# EAGLE design project2 (EAGLE 9.6.2)
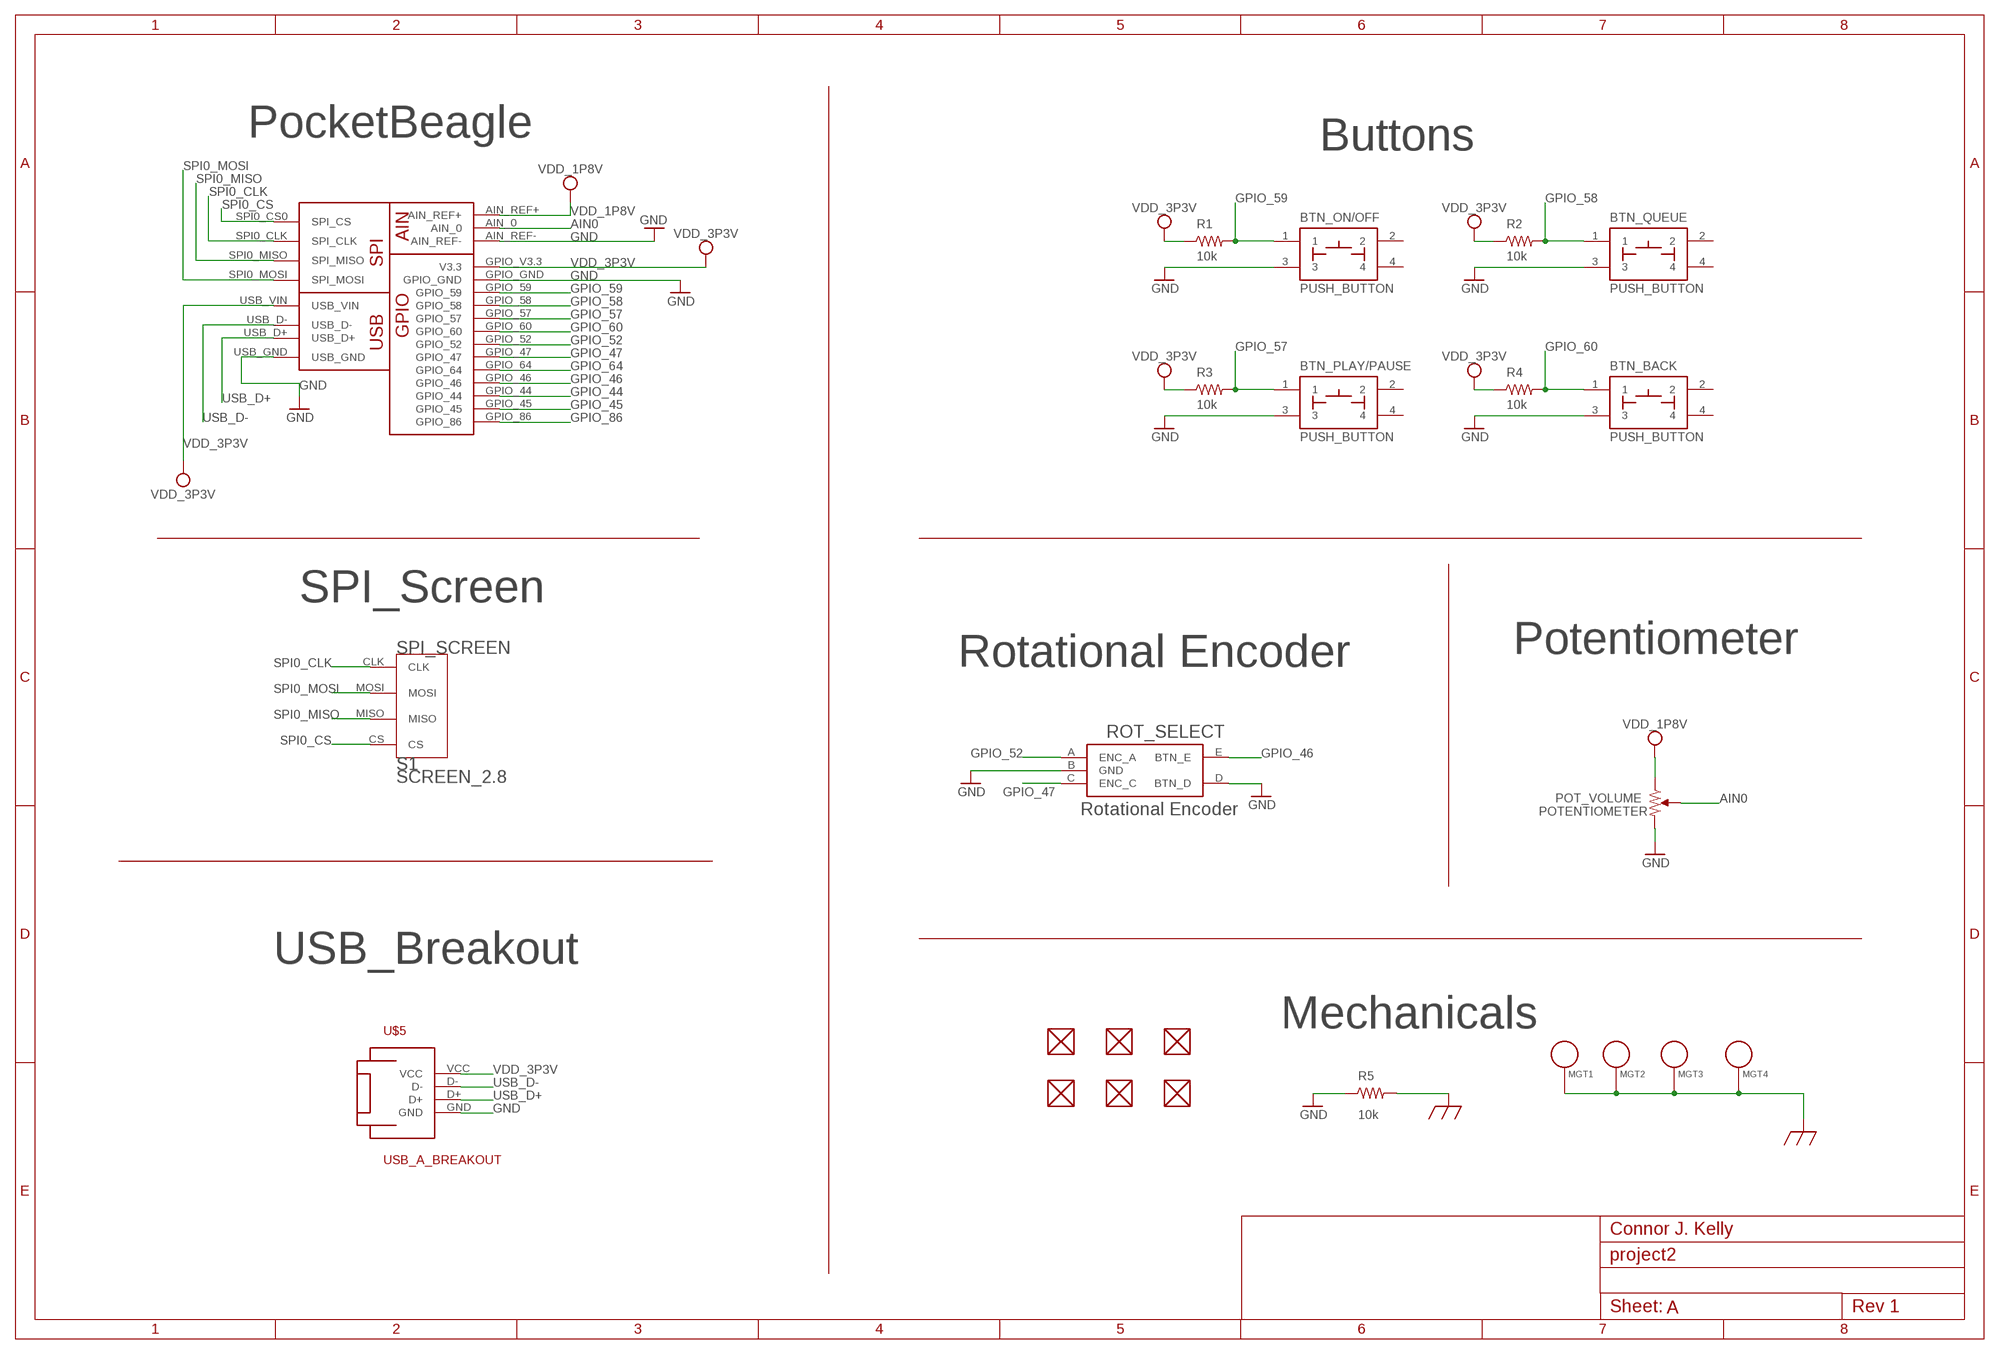
[diagram p0: schematic, sheet 1]

## Parts
BTN_BACK  PUSH_BUTTON  [BUTTON_12.5MM]
BTN_ON/OFF  PUSH_BUTTON  [BUTTON_12.5MM]
BTN_PLAY/PAUSE  PUSH_BUTTON  [BUTTON_12.5MM]
BTN_QUEUE  PUSH_BUTTON  [BUTTON_12.5MM]
FUD1  FIDUCIAL  [FIDUCIAL_40MIL]
FUD2  FIDUCIAL  [FIDUCIAL_40MIL]
FUD3  FIDUCIAL  [FIDUCIAL_40MIL]
FUD4  FIDUCIAL  [FIDUCIAL_40MIL]
FUD5  FIDUCIAL  [FIDUCIAL_40MIL]
FUD6  FIDUCIAL  [FIDUCIAL_40MIL]
MGT1  MOUNTING_HOLE  [MOUNTING_HOLE]
MGT2  MOUNTING_HOLE  [MOUNTING_HOLE]
MGT3  MOUNTING_HOLE  [MOUNTING_HOLE]
MGT4  MOUNTING_HOLE  [MOUNTING_HOLE]
POT_VOLUME  POTENTIOMETER  [POT-PO90S]
R1  10k  R_R0402  [R0402]
R2  10k  R_R0402  [R0402]
R3  10k  R_R0402  [R0402]
R4  10k  R_R0402  [R0402]
R5  10k  R_R0402  [R0402]
ROT_SELECT  PEC16-4015F-S0024  [PEC16-4015F-S0024]
S1  SCREEN_2.8  [SCREEN_2.8]
U$3  POCKETBEAGLE  [POCKETBEAGLE]
U$5  USB_A_BREAKOUT  [USB_A_BREAKOUT]

## Nets
AIN0: POT_VOLUME.S U$3.AIN_0
CGND: MGT1.P$1 MGT2.P$1 MGT3.P$1 MGT4.P$1 R5.2
GND: BTN_BACK.3 BTN_ON/OFF.3 BTN_PLAY/PAUSE.3 BTN_QUEUE.3 POT_VOLUME.CW R5.1 ROT_SELECT.B(GND) ROT_SELECT.D(BTN_D) U$3.AIN_REF- U$3.GPIO_GND U$3.USB_GND U$5.GND
GPIO_44: U$3.GPIO_44
GPIO_45: U$3.GPIO_45
GPIO_46: ROT_SELECT.E(BTN_E) U$3.GPIO_46
GPIO_47: ROT_SELECT.C(ENC_C) U$3.GPIO_47
GPIO_52: ROT_SELECT.A(ENC_A) U$3.GPIO_52
GPIO_57: BTN_PLAY/PAUSE.1 R3.2 U$3.GPIO_57
GPIO_58: BTN_QUEUE.1 R2.2 U$3.GPIO_58
GPIO_59: BTN_ON/OFF.1 R1.2 U$3.GPIO_59
GPIO_60: BTN_BACK.1 R4.2 U$3.GPIO_60
GPIO_64: U$3.GPIO_64
GPIO_86: U$3.GPIO_86
SPI0_CLK: S1.CLK U$3.SPI0_CLK(SPI_CLK)
SPI0_CS: S1.CS U$3.SPI0_CS0(SPI_CS)
SPI0_MISO: S1.MISO U$3.SPI0_MISO(SPI_MISO)
SPI0_MOSI: S1.MOSI U$3.SPI0_MOSI(SPI_MOSI)
USB_D+: U$3.USB_D+ U$5.D+
USB_D-: U$3.USB_D- U$5.D-
VDD_1P8V: POT_VOLUME.CCW U$3.AIN_REF+
VDD_3P3V: R1.1 R2.1 R3.1 R4.1 U$3.GPIO_V3.3(V3.3) U$3.USB_VIN U$5.VCC
Unconnected: BTN_BACK.2 BTN_BACK.4 BTN_ON/OFF.2 BTN_ON/OFF.4 BTN_PLAY/PAUSE.2 BTN_PLAY/PAUSE.4 BTN_QUEUE.2 BTN_QUEUE.4 FUD1.P$1 FUD2.P$1 FUD3.P$1 FUD4.P$1 FUD5.P$1 FUD6.P$1

## Notes on the sheet
- PocketBeagle | Buttons
- SPI_Screen
- Rotational Encoder | Potentiometer
- USB_Breakout
- Mechanicals
- Connor J. Kelly
- A

## Library data of the parts
BTN_BACK BTN_ON/OFF BTN_PLAY/PAUSE BTN_QUEUE = Project2_Main:PUSH_BUTTON: Momentary Press Button Switch; MF: Adafruit
FUD1-FUD6 = Project2_Main:FIDUCIAL
MGT1-MGT4 = Project2_Main:MOUNTING_HOLE: Chassis Mounting Hole w/GND connection ability
POT_VOLUME = Project2_Main:POTENTIOMETER: 10k Ohm 1 Gang Linear Through Hole Potentiometer Detent 1.0 Kierros Conductive Plastic 0.03W, 1/32W PC Pins, Board Locks; MF: TT Electronics/BI
R1-R5 = Project2_Main:R_: RESISTOR, American symbol; MF: Bournes Inc
ROT_SELECT = Project2_Main:PEC16-4015F-S0024: Mechanical Encoder Rotary Incremental Flat 0.02N.m Straight Quadrature Digital Square Wave 24PPR Through Hole PC Pin; DESCRIPTION: Mechanical Encoder Rotary Incremental Flat 0.02N.m Straight Quadrature Digital Square Wave 24PPR Through Hole PC Pin; MF: Bourns; MP: PEC16-4015F-S0024; PURCHASE-URL: https://pricing.snapeda.com/search/part/PEC16-4015F-S0024/?ref=eda
S1 = Project2_Main:SCREEN_2.8: SPI Screen, TFT, 2.8in; MF: Adafruit
U$3 = Project2_Main:POCKETBEAGLE: PocketBeagle is an ultra-tiny-yet-complete open-source USB-key-fob computer. PocketBeagle features an incredible low cost, slick design and simple usage, making PocketBeagle the ideal development board for beginners and professionals alike.; MF: BeagleBoard
U$5 = Project2_Main:USB_A_BREAKOUT: USB Breakout Board; MF: SparkFun

## Board
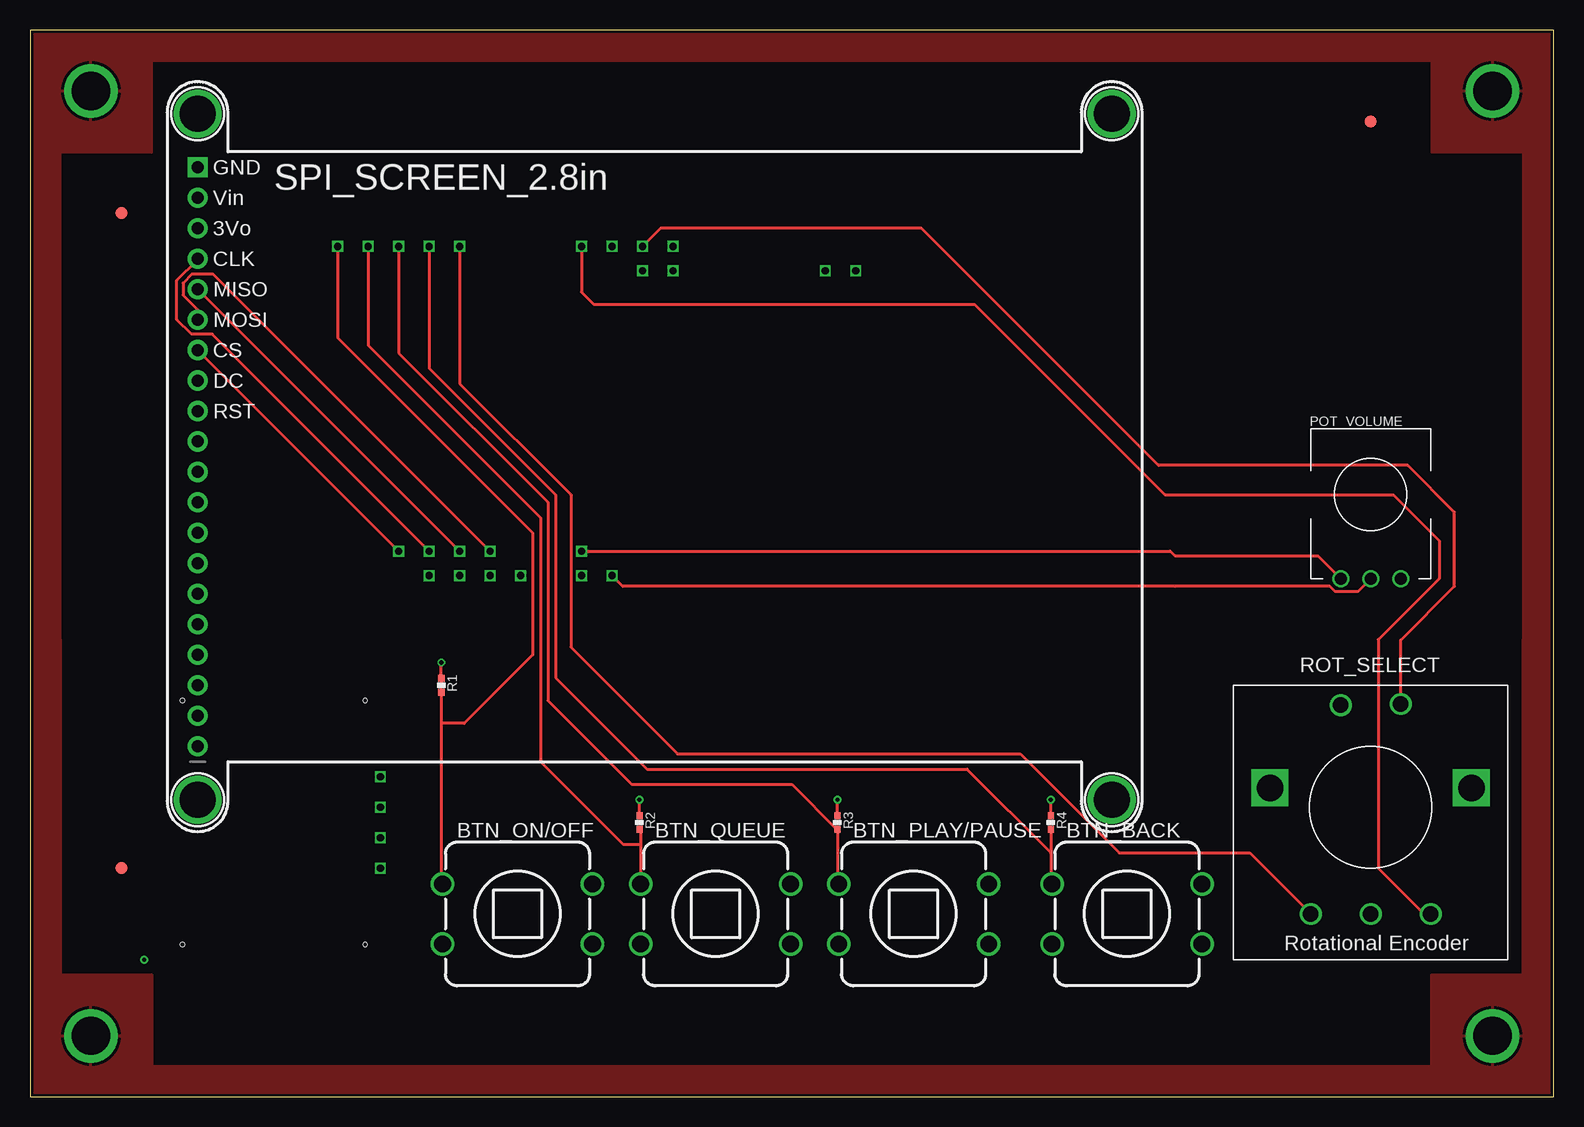
[diagram p1: board, top side]
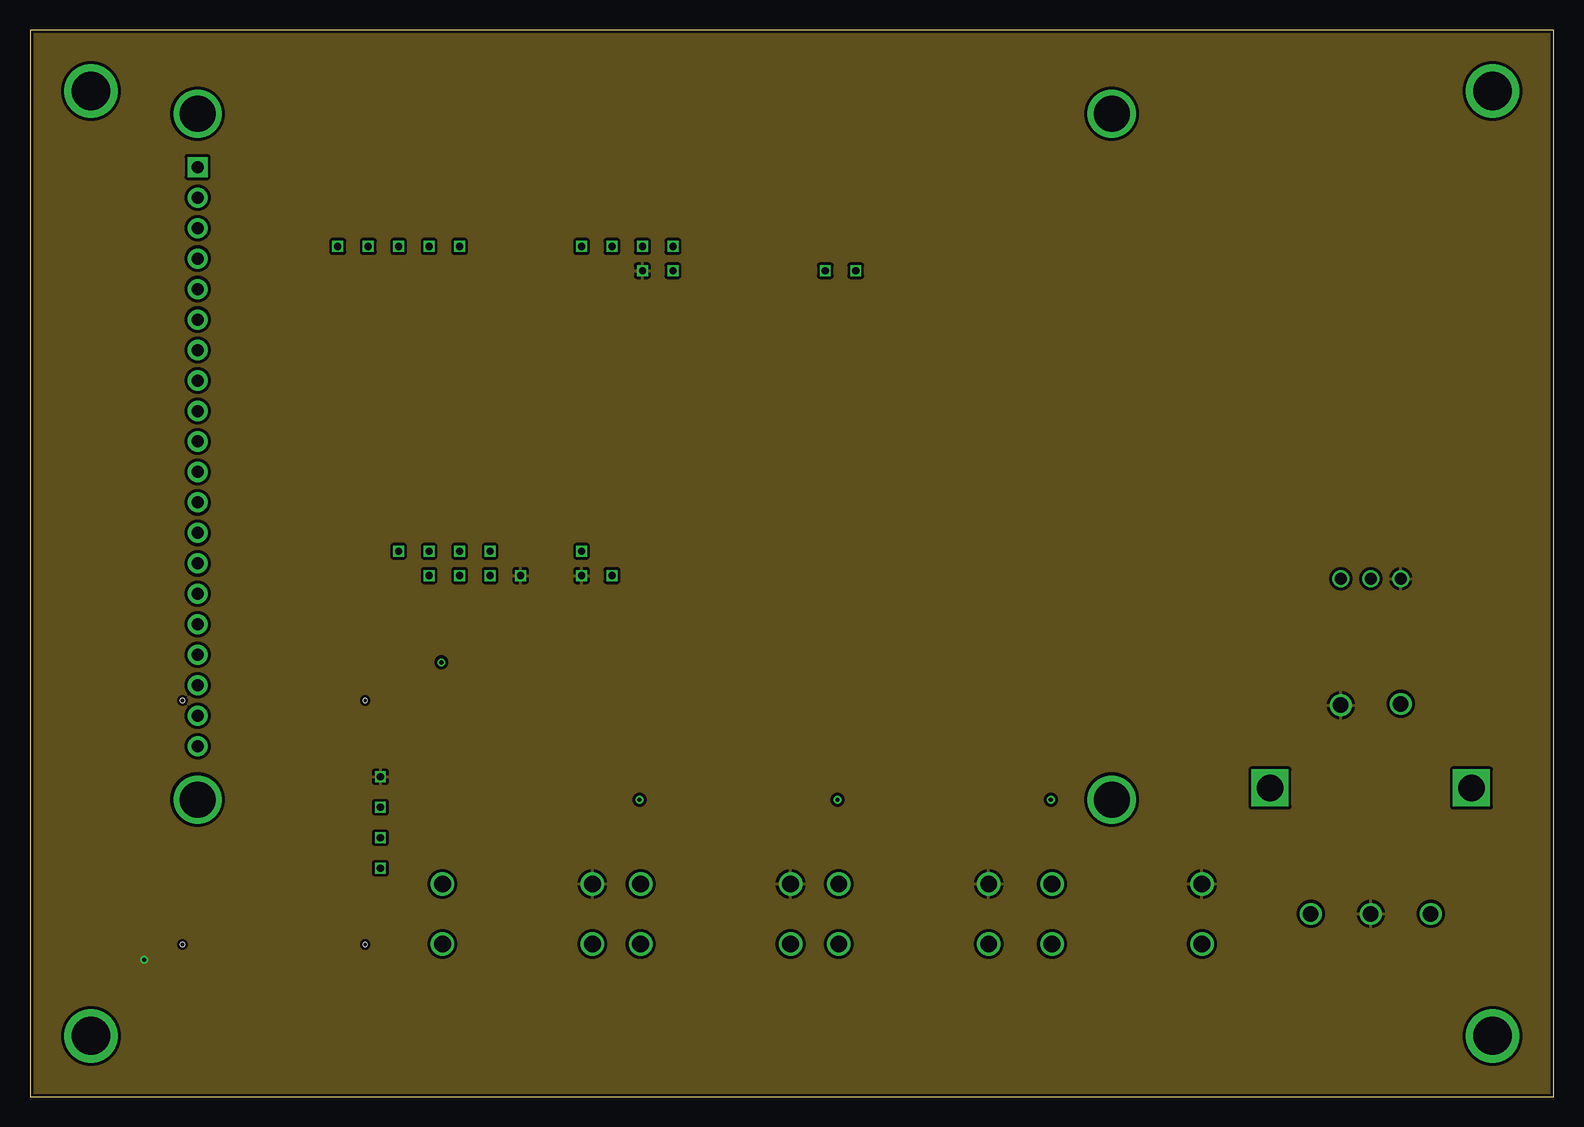
[diagram p2: board, inner layer Route2]
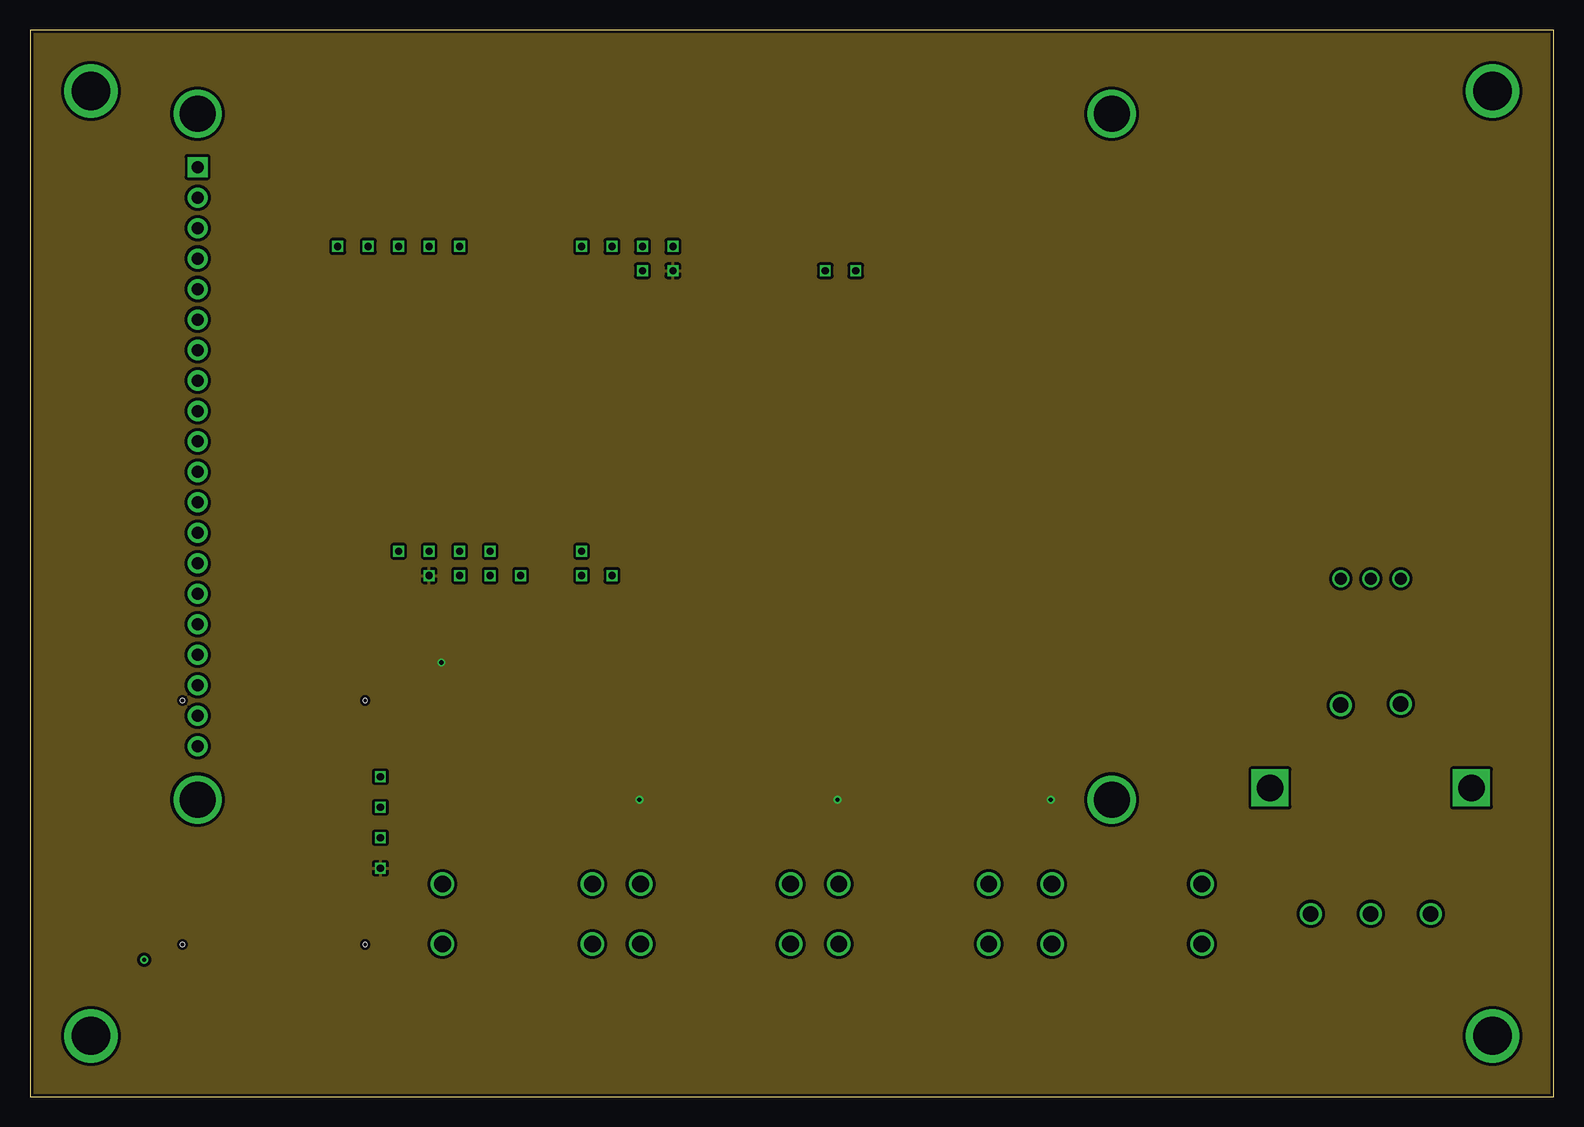
[diagram p3: board, inner layer Route15]
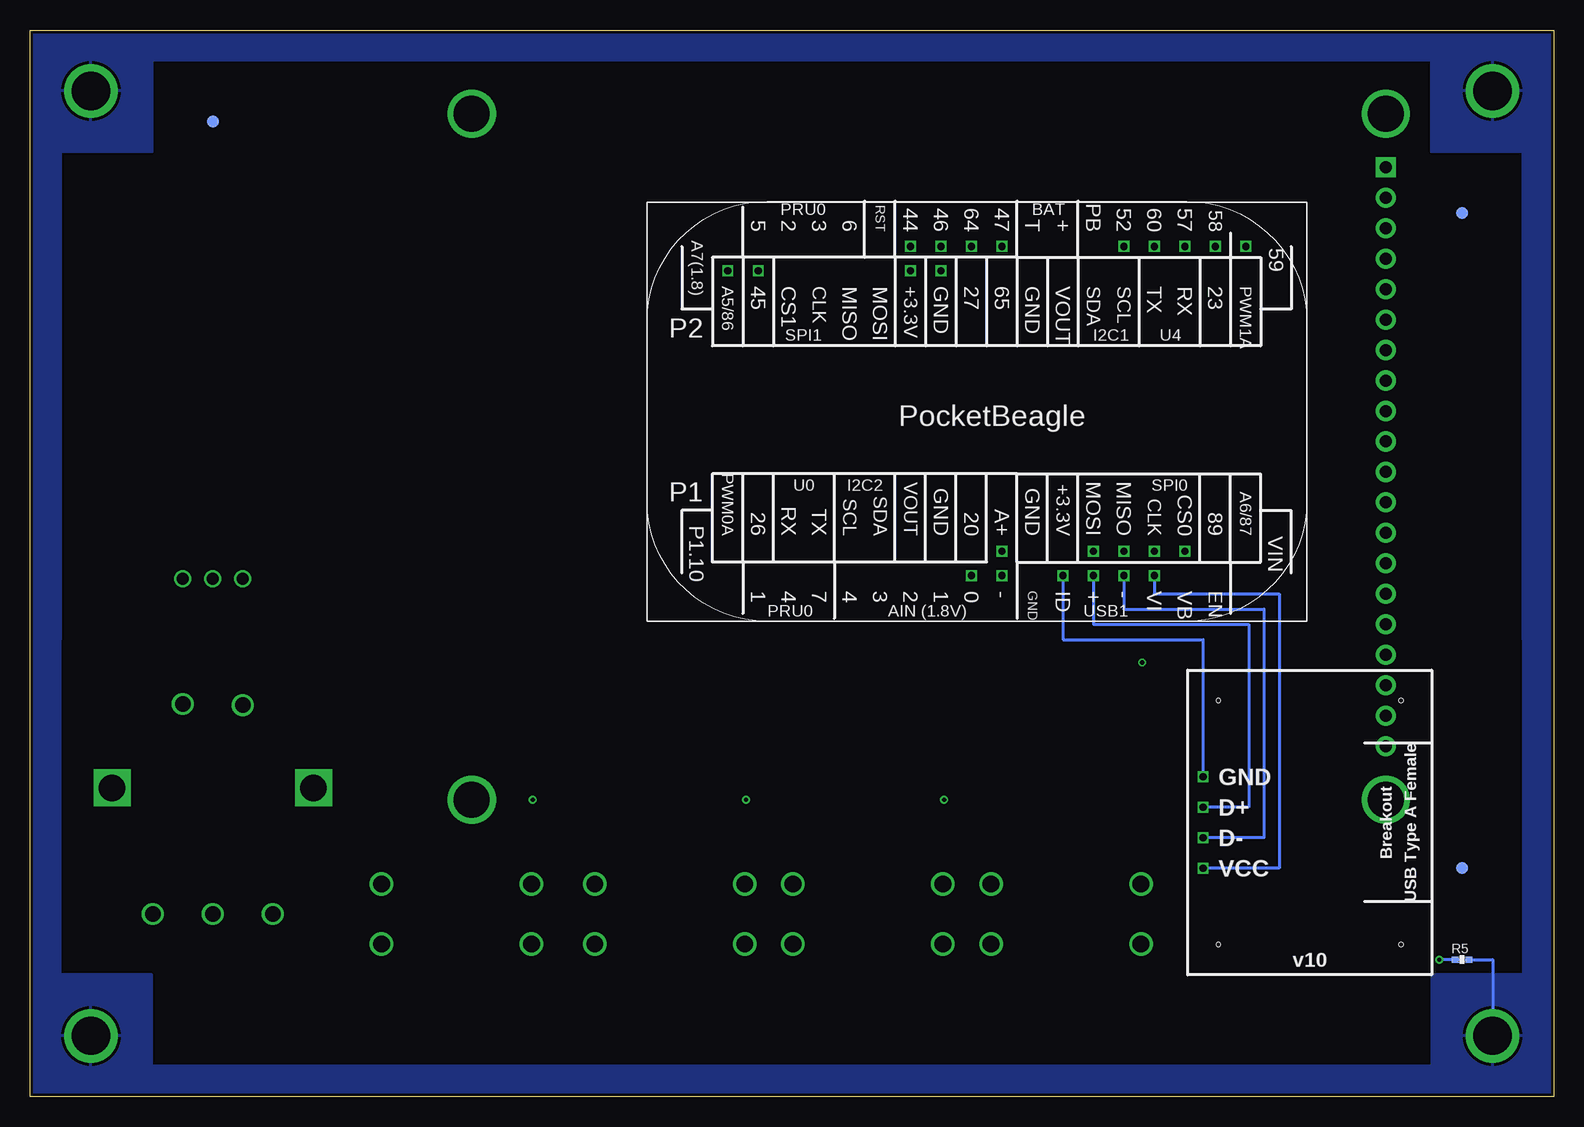
[diagram p4: board, bottom side, seen from below]

Size 127 x 88.9 mm. Coordinates in mm from the lower left corner, seen from the top.
Outline: 0,0 127,0 127,88.9 0,88.9 0,0
Copper layers (1*2*15*16): Top 0.035mm / dielectric 0.23mm / Route2 0.035mm / dielectric 0.93mm / Route15 0.035mm / dielectric 0.23mm / Bottom 0.035mm
Design rules "ENGI301_4lyr *": minimum track width 10mil, minimum drill 12mil, track to track 10mil, track to pad 10mil, pad to pad 10mil, via to via 10mil, smd to smd 10mil, copper to edge 10mil, drill to drill 12mil, minimum pad ring 6mil, minimum via ring 6mil, stop-mask expansion 3mil, vias tented up to drill 25mil, thermal gap 10mil

### Footprints (pad centres in the part's own frame; a part is rotated, then mirrored left to right if it is on the bottom)
BUTTON_12.5MM = drill 1.4: 1 -6.25,2.5; 2 -6.25,-2.5; 3 6.25,2.5; 4 6.25,-2.5
FIDUCIAL_40MIL = smd 1.016 x 1.016: P$1 0,0
MOUNTING_HOLE = drill 3.175 pad 4.445: P$1 0,0
POT-PO90S = drill 1: CCW -2.5,0; CW 2.5,0; S 0,0
R0402 = smd 0.61 x 0.508: 1 -0.559,0; 2 0.559,0
PEC16-4015F-S0024 = drill 2.2 square: 1 -8.4,10.5; 2 8.4,10.5 | drill 1.3: A -5,0; B 0,0; C 5,0; D -2.5,17.4; E 2.5,17.5
SCREEN_2.8 = drill 1 pad 1.676: 3VO -19.05,-38.1; 10@JP2 -1.27,-38.1; 11@JP2 1.27,-38.1; 12@JP2 3.81,-38.1; 13@JP2 6.35,-38.1; 14@JP2 8.89,-38.1; 15@JP2 11.43,-38.1; 16@JP2 13.97,-38.1; 17@JP2 16.51,-38.1; 18@JP2 19.05,-38.1; 19@JP2 21.59,-38.1; 20@JP2 24.13,-38.1; CLK -16.51,-38.1; CS -8.89,-38.1; DC -6.35,-38.1; MISO -13.97,-38.1; MOSI -11.43,-38.1; RST -3.81,-38.1; VIN -21.59,-38.1 | drill 1 pad 1.676 square: GND -24.13,-38.1 | drill 3 pad 3.6: P$1@U$7 -28.575,-38.1; P$1@U$15 28.575,-38.1; P$1@U$16 -28.575,38.1; P$1@U$17 28.575,38.1
POCKETBEAGLE = drill 0.6 square: AIN_0 28.194,4.064; AIN_REF+ 25.654,6.096; AIN_REF- 25.654,4.064; GPIO_44 33.274,31.496; GPIO_45 45.974,29.464; GPIO_46 30.734,31.496; GPIO_47 25.654,31.496; GPIO_52 15.494,31.496; GPIO_57 10.414,31.496; GPIO_58 7.874,31.496; GPIO_59 5.334,31.496; GPIO_60 12.954,31.496; GPIO_64 28.194,31.496; GPIO_86 48.514,29.464; GPIO_GND 30.734,29.464; GPIO_V3.3 33.274,29.464; SPI0_CLK 12.954,6.096; SPI0_CS0 10.414,6.096; SPI0_MISO 15.494,6.096; SPI0_MOSI 18.034,6.096; USB_D+ 18.034,4.064; USB_D- 15.494,4.064; USB_GND 20.574,4.064; USB_VIN 12.954,4.064
USB_A_BREAKOUT = drill 0.6 square: D+ 19.05,11.43; D- 19.05,13.97; GND 19.05,8.89; VCC 19.05,16.51 | hole 0.35: 2.54,22.86; 17.78,22.86; 17.78,2.54; 2.54,2.54

### Placement (x,y rotation side)
BTN_BACK  91.44,15.24 0 top
BTN_ON/OFF  40.64,15.24 0 top
BTN_PLAY/PAUSE  73.66,15.24 0 top
BTN_QUEUE  57.15,15.24 0 top
FUD1  7.62,19.05 0 top
FUD2  111.76,81.28 0 top
FUD3  7.62,73.66 0 top
FUD4  7.62,19.05 270 bottom
FUD5  7.62,73.66 0 bottom
FUD6  111.76,81.28 0 bottom
MGT1  5.08,83.82 0 top
MGT2  121.92,5.08 0 bottom
MGT3  121.92,83.82 0 top
MGT4  5.08,5.08 0 bottom
POT_VOLUME  111.76,43.18 0 top
R1  34.29,34.29 270 top
R2  50.8,22.86 270 top
R3  67.31,22.86 270 top
R4  85.09,22.86 270 top
R5  7.62,11.43 0 bottom
ROT_SELECT  111.76,15.24 0 top
S1  52.07,53.34 270 top
U$3  20.32,39.37 0 top
U$5  10.16,35.56 180 bottom

### Tracks (layer width: path | path; a pad name or v marks a point on that pad's centre or on a via)
AIN0
  Top 0.254: POT_VOLUME.S 110.68,42.1 108.81,42.1 108.37,42.54 95.44,42.54 95.44,42.55 49.4,42.55 U$3.AIN_0
CGND
  Bottom 0.254: R5.2 5.08,11.43 MGT4.P$1
  pour Top: -2.54,38.1 2.54,38.1 2.54,78.74 10.16,78.74 10.16,86.36 116.84,86.36 116.84,78.74 124.46,78.74 124.46,38.1 129.54,38.1 129.54,91.44 -2.54,91.44
  pour Top: -2.54,38.1 2.54,38.1 2.54,10.16 10.16,10.16 10.16,2.54 116.84,2.54 116.84,10.16 124.46,10.16 124.46,38.1 129.54,38.1 129.54,-2.54 -2.54,-2.54
  pour Bottom: -2.54,38.1 2.54,38.1 2.54,78.74 10.16,78.74 10.16,86.36 116.84,86.36 116.84,78.74 124.46,78.74 124.46,38.1 130.18,38.1 130.18,91.44 -2.54,91.44
  pour Bottom: -2.54,38.1 2.54,38.1 2.54,10.16 5.08,10.16 10.16,10.16 10.16,2.54 116.84,2.54 116.84,10.16 124.46,10.16 124.46,38.1 129.54,38.1 129.54,-2.54 -2.54,-2.54
GND  (via drill 0.35)
  Bottom 0.254: R5.1 v9.53,11.43 | U$3.USB_GND 40.89,38.1 29.21,38.1 U$5.GND
  pour Route2: -2.54,91.44 129.54,91.44 129.54,-2.54 -2.54,-2.54
GPIO_46
  Top 0.254: ROT_SELECT.E 114.26,38.06 118.75,42.55 118.75,48.72 114.85,52.62 94.06,52.62 74.3,72.39 52.58,72.39 U$3.GPIO_46
GPIO_47
  Top 0.254: U$3.GPIO_47 45.97,67.06 46.99,66.04 78.74,66.04 94.62,50.16 96.45,50.16 96.46,50.16 113.67,50.16 117.47,46.35 117.47,43.18 112.39,38.1 112.39,19.05 116.2,15.24 ROT_SELECT.C
GPIO_52
  Top 0.254: U$3.GPIO_52 35.81,59.44 45.09,50.16 45.09,37.47 53.98,28.57 82.55,28.57 90.81,20.32 101.68,20.32 ROT_SELECT.A
GPIO_57
  Top 0.254: R3.2 67.31,22.23 | 67.31,22.23 67.31,17.74 BTN_PLAY/PAUSE.1 | U$3.GPIO_57 30.73,61.98 43.18,49.53 43.18,33.02 50.16,26.04 63.5,26.04 67.31,22.23
GPIO_58
  Top 0.254: R2.2 50.9,22.3 50.9,21.03 | 50.9,21.03 BTN_QUEUE.1 | U$3.GPIO_58 28.19,62.61 42.55,48.26 42.55,27.94 49.45,21.03 50.9,21.03
GPIO_59
  Top 0.254: R1.2 34.29,31.11 | 34.29,31.11 34.29,17.74 BTN_ON/OFF.1 | U$3.GPIO_59 25.65,63.25 41.91,46.99 41.91,36.83 36.2,31.11 34.29,31.11
GPIO_60
  Top 0.254: R4.2 85.09,20.32 | 85.09,20.32 85.09,17.74 BTN_BACK.1 | U$3.GPIO_60 33.27,60.71 43.81,50.16 43.81,34.92 51.44,27.3 78.11,27.3 85.09,20.32
SPI0_CLK
  Top 0.254: U$3.SPI0_CLK 15.19,63.55 13.46,63.55 12.24,64.77 12.24,68.03 13.97,69.75 S1.CLK
SPI0_CS
  Top 0.254: U$3.SPI0_CS0 S1.CS
SPI0_MISO
  Top 0.254: U$3.SPI0_MISO S1.MISO
SPI0_MOSI
  Top 0.254: S1.MOSI 13.97,65.59 12.75,66.81 12.75,67.81 13.46,68.53 15.29,68.53 U$3.SPI0_MOSI
USB_D+
  Bottom 0.254: U$3.USB_D+ 38.35,39.37 25.4,39.37 25.4,24.13 U$5.D+
USB_D-
  Bottom 0.254: U$3.USB_D- 35.81,40.64 24.13,40.64 24.13,21.59 U$5.D-
VDD_1P8V
  Top 0.254: U$3.AIN_REF+ 95.06,45.47 95.44,45.08 107.36,45.08 POT_VOLUME.CCW
VDD_3P3V  (via drill 0.35)
  Top 0.254: R1.1 v34.29,36.2 | R2.1 v50.8,24.77 | R3.1 v67.31,24.77 | R4.1 v85.09,24.77
  Bottom 0.254: 33.27,43.18 U$3.USB_VIN 33.27,41.91 22.86,41.91 22.86,19.05 U$5.VCC
  pour Route15: -7.62,96.52 132.08,96.52 134.62,96.52 134.62,-7.62 -7.62,-7.62

### Text on the board
tDocu: Box O' Music | Connor J. Kelly | ENGI 301 | REV1.0 | 05/02/23